# Altium schematic sheet 6_CAN.SchDoc: Apalis Evaluation Board 1.1
size A3; Organization: Toradex AG; Address1: Altsagenstrasse 5; Address2: Horw; Address3: 6048; Address4: Switzerland; DocumentNumber: 19; Revision: V1.1; SheetNumber: 5; SheetTotal: 19; PageSetup: Record=PageOptions|CenterHorizontal=True|CenterVertical=True|PrintScale=0.73|XCorrection=1.00|YCorrection=1.00|PrintKind=0|BorderSize=5000000|LeftOffset=0|BottomOffset=0|Orientation=2|PaperLength=1000|PaperWidth=1000|Scale=100|PaperSource=7|PrintQuality=-4|MediaType=1|DitherType=10|PaperKind=A4|PrintScaleMode=1
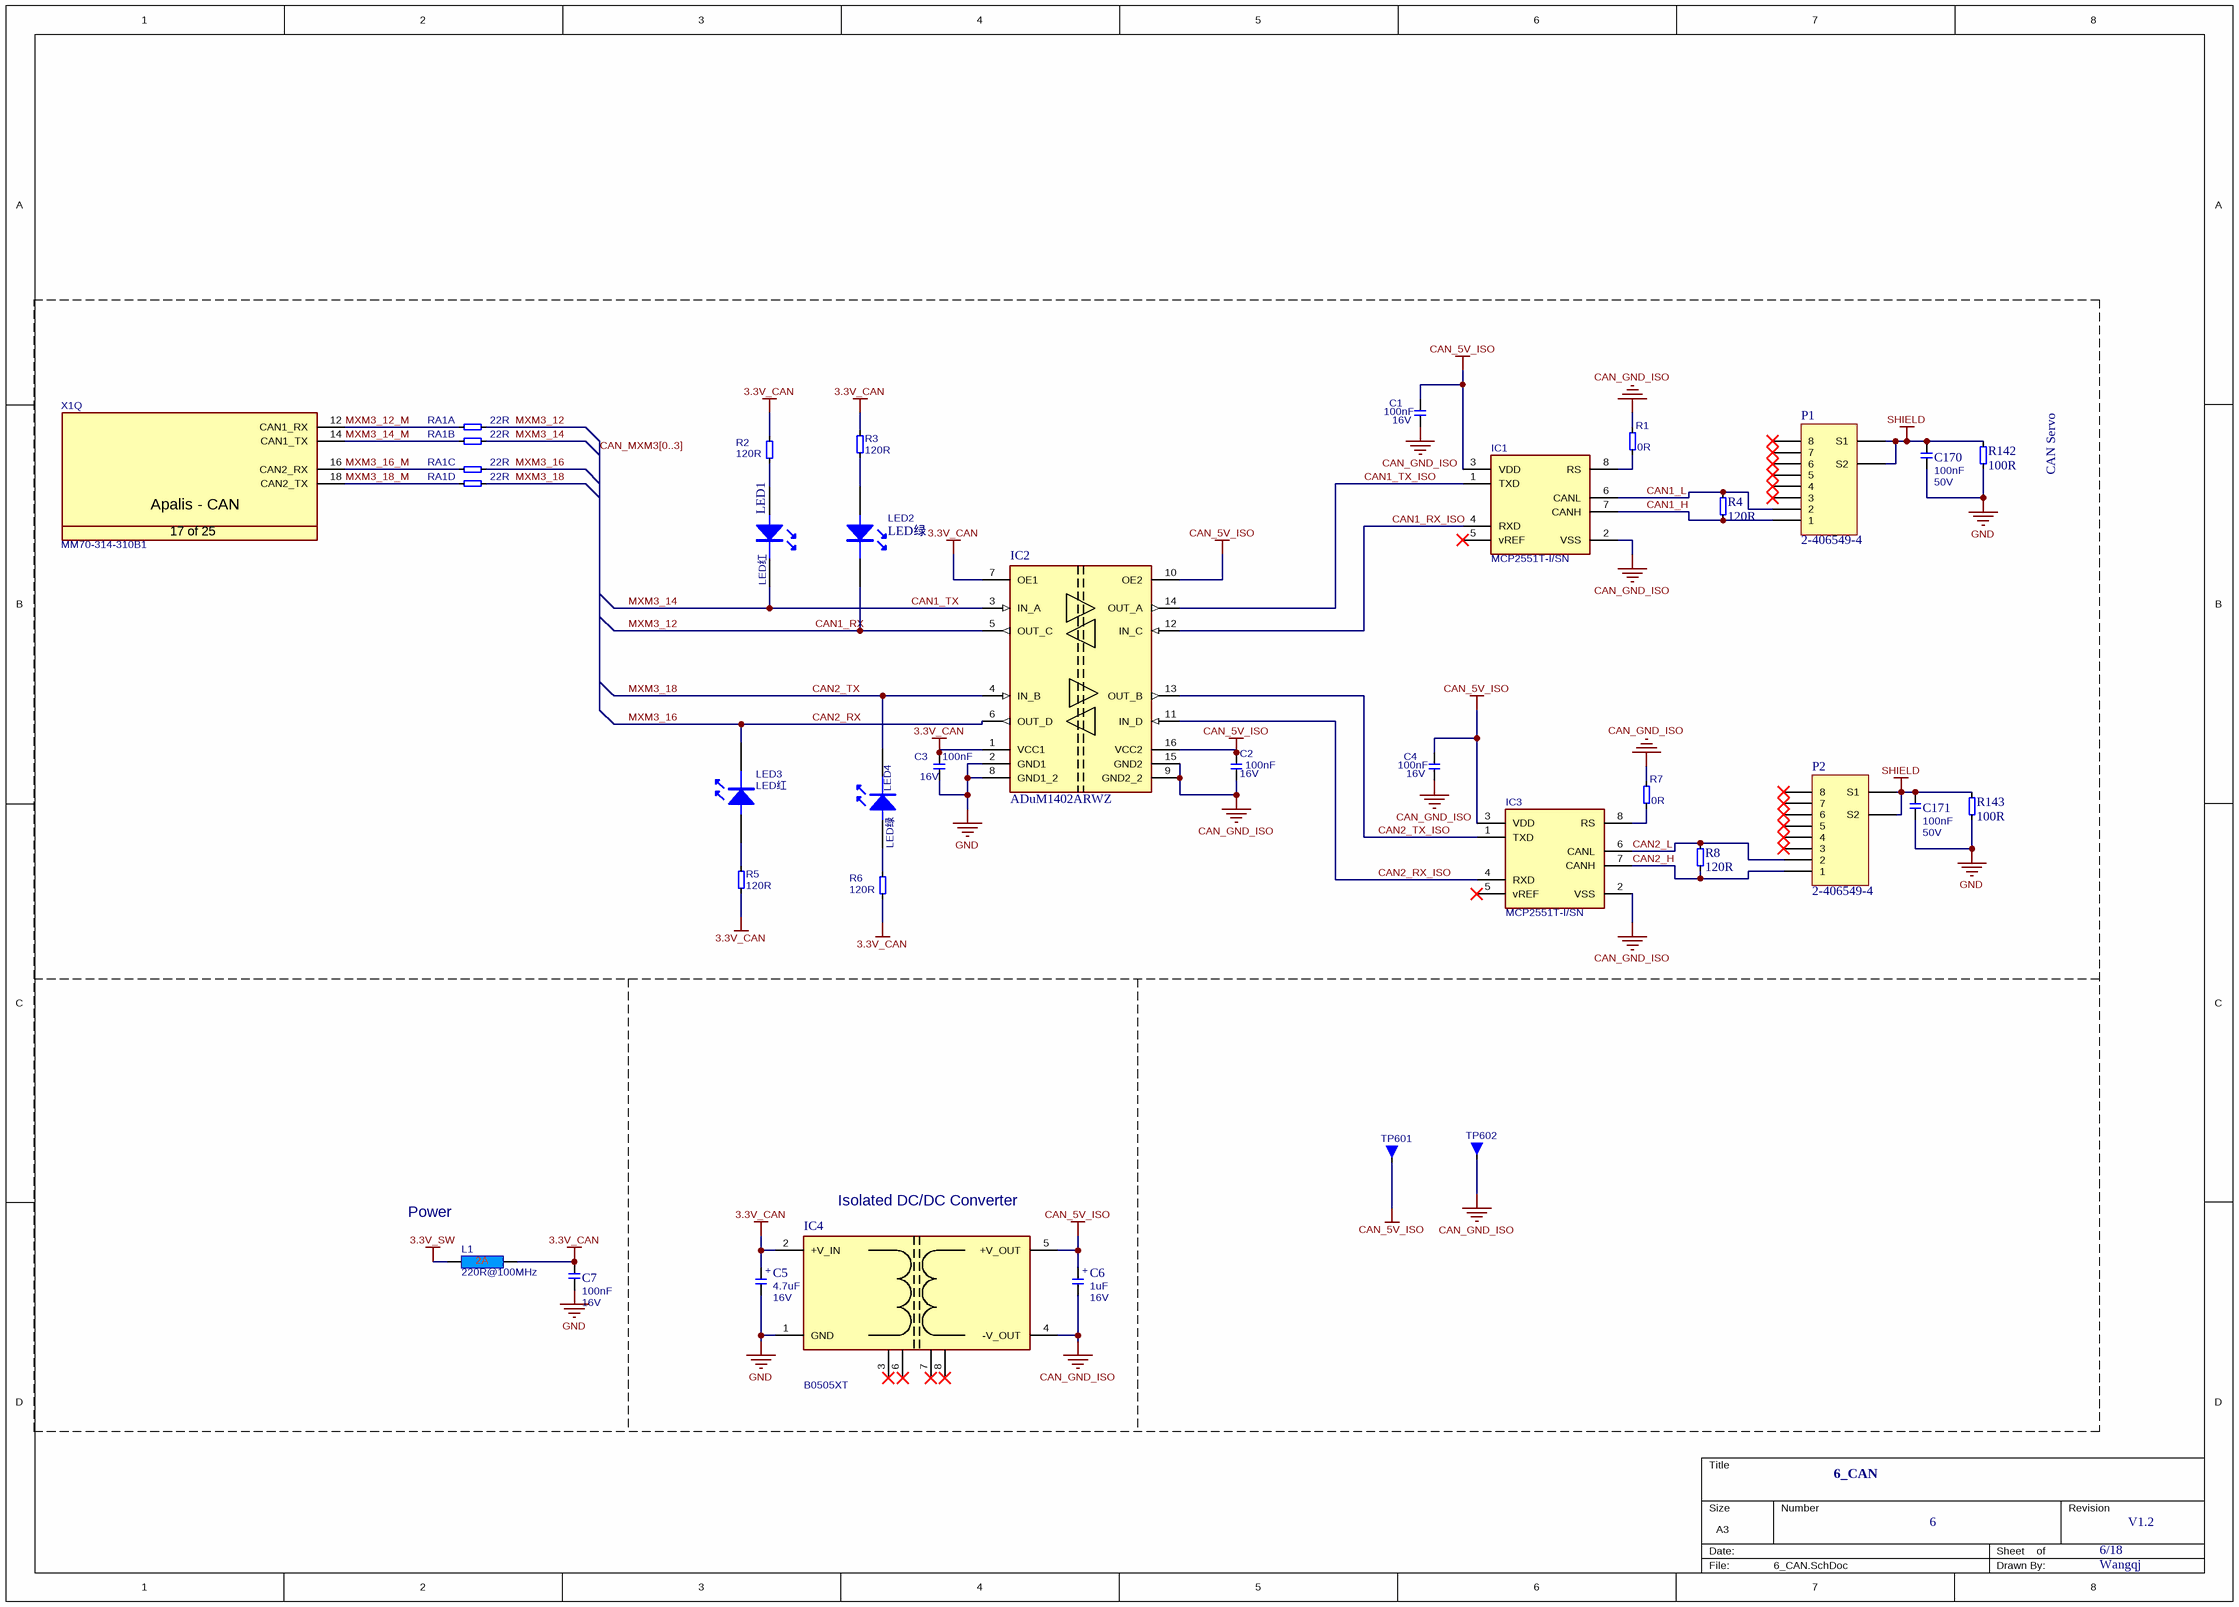
[diagram p0: 6_CAN.SchDoc]

## Parts
C1  Rating: 16V  [T_CAPC0603X33N]  (hidden comment: 100nF)
C2  Rating: 16V  [T_CAPC0603X33N]  (hidden comment: 100nF)
C3  Rating: 16V  [T_CAPC0603X33N]  (hidden comment: 100nF)
C4  Rating: 16V  [T_CAPC0603X33N]  (hidden comment: 100nF)
C5  Rating: 16V  [T_CAPMP3216X180N]  (hidden comment: 4.7uF)
C6  Rating: 16V  [T_CAPMP3216X180N]  (hidden comment: 1uF)
C7  Rating: 16V  [T_CAPC0603X33N]  (hidden comment: 100nF)
C170  Rating: 50V  [T_CAPC0603X33N]  (hidden comment: 100nF)
C171  Rating: 50V  [T_CAPC0603X33N]  (hidden comment: 100nF)
IC1  MCP2551T-I/SN  [SOIC127P600X173-8N]
IC2  ADuM1402ARWZ  [T_AD_ADuM1300ARW]
IC3  MCP2551T-I/SN  [SOIC127P600X173-8N]
IC4  Manufacturer Part No.: B0505XT  [MORNSUN_B0305XT-1W_SMD]  (hidden comment: B0505XT-1W)
L1  220R@100MHz  [INDC1608X95N]
LED1  LED红  [LC-0805_LED_S3]
LED2  LED绿  [LC-0805_LED_S3]
LED3  LED红  [LC-0805_LED_S3]
LED4  LED绿  [LC-0805_LED_S3]
P1  2-406549-4  [RJ45卡口朝上]
P2  2-406549-4  [RJ45卡口朝上]
R1  0R  [T_RESC0603X30N]
R2  120R  [T_RESC0603X30N]
R3  120R  [T_RESC0603X30N]
R4  120R  [T_RESC0603X30N]
R5  120R  [T_RESC0603X30N]
R6  120R  [T_RESC0603X30N]
R7  0R  [T_RESC0603X30N]
R8  120R  [T_RESC0603X30N]
R142  100R  [T_RESC0603X30N]
R143  100R  [T_RESC0603X30N]
RA1  22R  [T_Resistor_Array_X4]  (parts A,B,C,D of 4)
TP601  Testpin  [T_TP-THT]  (value not drawn)
TP602  Testpin  [T_TP-THT]  (value not drawn)
X1  Manufacturer Part No.: MM70-314-310B1  [T_JAE_MM70-314-310B1]  (hidden comment: CON-JAE-MM70-314-310B1-314-0.5mm)  (part Q of 25)

## Nets
3.3V_CAN: C3.2 C5.1 C7.2 IC2.1(VCC1) IC2.7(OE1) IC4.2(+V_IN) L1.2 R2.2 R3.2 R5.1 R6.1
3.3V_SW: L1.1
CAN_5V_ISO: C1.2 C2.2 C4.2 C6.1 IC1.3(VDD) IC2.10(OE2) IC2.16(VCC2) IC3.3(VDD) IC4.5(+V_OUT) TP601.1
CAN_GND_ISO: C1.1 C2.1 C4.1 C6.2 IC1.2(VSS) IC2.9(GND2_2) IC2.15(GND2) IC3.2(VSS) IC4.4(-V_OUT) R1.2 R7.2 TP602.1
GND: C3.1 C5.2 C7.1 C170.1 C171.1 IC2.2(GND1) IC2.8(GND1_2) IC4.1(GND) R142.1 R143.1
SHIELD: C170.2 C171.2 P1.S1 P1.S2 P2.S1 P2.S2 R142.2 R143.2
CAN1_H: IC1.7(CANH) P1.1 R4.1
CAN1_L: IC1.6(CANL) P1.2 R4.2
CAN1_RX: IC2.5(OUT_C) LED2.K RA1.5  [also labelled MXM3_12]
CAN1_RX_ISO: IC1.4(RXD) IC2.12(IN_C)
CAN1_TX: IC2.3(IN_A) LED1.K RA1.6  [also labelled MXM3_14]
CAN1_TX_ISO: IC1.1(TXD) IC2.14(OUT_A)
CAN2_H: IC3.7(CANH) P2.1 R8.1
CAN2_L: IC3.6(CANL) P2.2 R8.2
CAN2_RX: IC2.6(OUT_D) LED3.K RA1.7  [also labelled MXM3_16]
CAN2_RX_ISO: IC2.11(IN_D) IC3.4(RXD)
CAN2_TX: IC2.4(IN_B) LED4.K RA1.8  [also labelled MXM3_18]
CAN2_TX_ISO: IC2.13(OUT_B) IC3.1(TXD)
MXM3_12_M: RA1.1 X1.12(CAN1_RX)
MXM3_14_M: RA1.2 X1.14(CAN1_TX)
MXM3_16_M: RA1.3 X1.16(CAN2_RX)
MXM3_18_M: RA1.4 X1.18(CAN2_TX)
NetIC1_8: IC1.8(RS) R1.1
NetIC3_8: IC3.8(RS) R7.1
NetLED1_A: LED1.A R2.1
NetLED2_A: LED2.A R3.1
NetLED3_A: LED3.A R5.2
NetLED4_A: LED4.A R6.2

Not connected (* = marked no-connect by the designer): IC1 5(vREF)*; IC3 5(vREF)*; IC4 3(NC)* 6(NC)* 7(NC)* 8(NC)*; P1 3* 4* 5* 6* 7* 8*; P2 3* 4* 5* 6* 7* 8*

## Buses and harness runs
bus CAN_MXM3[0..3]

## Notes on the sheet
- CAN Servo
- (near L1) Power
- (near IC4) Isolated DC/DC Converter
- 6_CAN
- 6
- 6/18
- V1.2
- Wangqj
- (in symbol C-1uF-16V-10%-3216-TA) +
- (in symbol C-4.7uF-16V-10%-3216-TA) +
- (in symbol CON-JAE-MM70-314-310B1-314-0.5mm, part Q) Apalis - CAN; 17 of 25

## Library data of the parts
C1-C4 = C-X7R-100nF-16V-10%-0603: Capacitor Ceramic X7R 100nF 16V 10% 0603; Tolerance: 10%; Type: X7R; Value: 100nF
C5 = C-4.7uF-16V-10%-3216-TA: Capacitor TA 4.7uF 16V 10% 3216; Tolerance: 10%; Type: TA; Value: 4.7uF
C6 = C-1uF-16V-10%-3216-TA: Capacitor TA 1uF 16V 10% 3216; Tolerance: 10%; Type: TA; Value: 1uF
C7 = C-100nF-16V-10%-0603-X7R: Capacitor Ceramic X7R 100nF 16V 10% 0603; Tolerance: 10%; Type: X7R; Value: 100nF
C170 C171 = C-100nF-50V-20%-0603-X7R: Capacitor Ceramic X7R 100nF 50V 20% 0603; Tolerance: 20%; Type: X7R; Value: 100nF
IC1 IC3 = IC-MC-MCP2551T-I/SN: High speed CAN Transceiver; Manufacturer Name: Microchip; Manufacturer Part No.: MCP2551T-I/SN
IC2 = IC-AD-ADuM1402ARWZ: Digital Isolator
IC4 = IC-MORNSUN-B0505XT-SMD: MORNSUN Isolated DC/DC Converter; Manufacturer Name: Murata
L1 = L-220R@100MHz-2A-25%-0603: 220R@100MHz 2A EMI FILTER; Tolerance: 25%; Rating: 2A; Value: 220R@100MHz
LED1-LED4 = LED: 0805LED绿
P1 P2 = CON-TECon-8Header: 网口
R1 R7 = R-0R-63mW-1%-0603: Resistor 0 ohm 63mW 1% 0603; Rating: 63mW; Tolerance: 1%; Value: 0R
R2 R3 R5 R6 = R-100KR-63mW-5%-0603: Resistor 100 Kohm 63mW 5% 0603; Value: 100KR; Rating: 63mW; Tolerance: 5%
R4 R8 = R-120R-250mW-5%-0603: Resistor 120 ohm 250mW 5% 0603; Rating: 250mW; Tolerance: 5%; Value: 120R
R142 R143 = R-120R-63mW-5%-0603: Resistor 120 ohm 63mW 5% 0603; Rating: 63mW; Tolerance: 5%; Value: 100R
RA1 = RA-22R-63mW-5%-1206-div: Resistor Array 22 R 63mW 5% 1206; Tolerance: 5%; Power Dissipation: 63mW; Value: 22R
TP601 TP602 = Testpin: Testpin TH
X1 = CON-JAE-MM70-314-310B1-314-0.5mm: MXM3 Connector; Manufacturer Name: JAE; No. of ways: 314